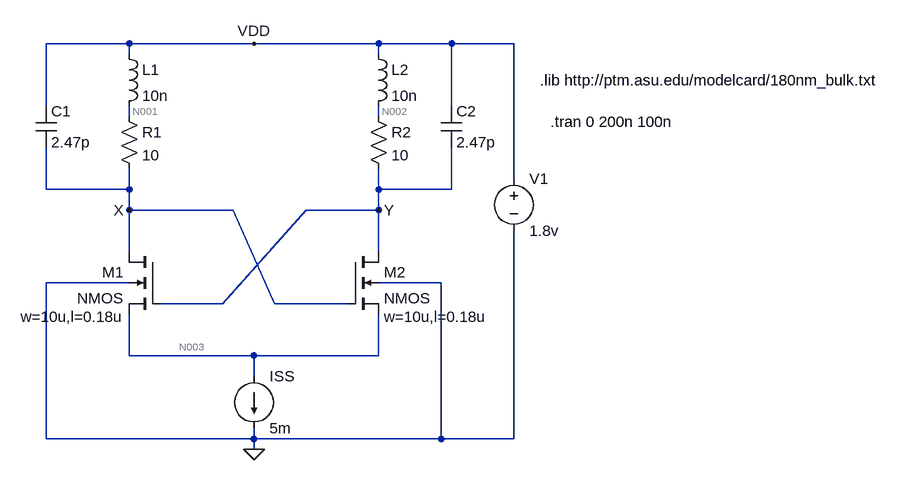
[diagram p0: schematic Draft1.asc]
Draft1.asc, the LTspice schematic file:
Version 4
SHEET 1 1128 740
WIRE -112 -16 -240 -16
WIRE 80 -16 -112 -16
WIRE 272 -16 80 -16
WIRE 384 -16 272 -16
WIRE 480 -16 384 -16
WIRE -112 0 -112 -16
WIRE 272 0 272 -16
WIRE -240 80 -240 -16
WIRE 384 80 384 -16
WIRE -112 96 -112 80
WIRE 272 96 272 80
WIRE 480 192 480 -16
WIRE -240 208 -240 144
WIRE -112 208 -112 176
WIRE -112 208 -240 208
WIRE 272 208 272 176
WIRE 384 208 384 144
WIRE 384 208 272 208
WIRE -112 240 -112 208
WIRE 48 240 -112 240
WIRE 272 240 272 208
WIRE 272 240 160 240
WIRE -112 304 -112 240
WIRE 272 304 272 240
WIRE -112 352 -240 352
WIRE 368 352 272 352
WIRE 32 384 160 240
WIRE 32 384 -64 384
WIRE 112 384 48 240
WIRE 224 384 112 384
WIRE -112 464 -112 400
WIRE 80 464 -112 464
WIRE 272 464 272 400
WIRE 272 464 80 464
WIRE 80 496 80 464
WIRE -240 592 -240 352
WIRE 80 592 80 576
WIRE 80 592 -240 592
WIRE 368 592 368 352
WIRE 368 592 80 592
WIRE 480 592 480 272
WIRE 480 592 368 592
WIRE 80 608 80 592
FLAG 80 608 0
FLAG 272 240 Y
FLAG -112 240 X
FLAG 80 -16 VDD
SYMBOL cap -256 80 R0
SYMATTR InstName C1
SYMATTR Value 2.47p
SYMBOL ind -128 -16 R0
SYMATTR InstName L1
SYMATTR Value 10n
SYMBOL ind 256 -16 R0
SYMATTR InstName L2
SYMATTR Value 10n
SYMBOL cap 368 80 R0
SYMATTR InstName C2
SYMATTR Value 2.47p
SYMBOL nmos4 -64 304 M0
WINDOW 123 56 100 Left 2
SYMATTR InstName M1
SYMATTR Value2 w=10u,l=0.18u
SYMBOL nmos4 224 304 R0
WINDOW 123 56 100 Left 2
SYMATTR InstName M2
SYMATTR Value2 w=10u,l=0.18u
SYMBOL current 80 496 R0
SYMATTR InstName ISS
SYMATTR Value 5m
SYMBOL res -128 80 R0
SYMATTR InstName R1
SYMATTR Value 10
SYMBOL res 256 80 R0
SYMATTR InstName R2
SYMATTR Value 10
SYMBOL voltage 480 176 R0
SYMATTR InstName V1
SYMATTR Value 1.8v
TEXT 520 40 Left 2 !.lib http://ptm.asu.edu/modelcard/180nm_bulk.txt
TEXT 536 104 Left 2 !.tran 0 200n 100n

The netlist it stands for:
* Draft1.asc
C1 VDD X 2.47p
L1 VDD N001 10n
L2 VDD N002 10n
C2 VDD Y 2.47p
M1 X Y N003 0 NMOS w=10u,l=0.18u
M2 Y X N003 0 NMOS w=10u,l=0.18u
ISS N003 0 5m
R1 N001 X 10
R2 N002 Y 10
V1 VDD 0 1.8v
.model NMOS NMOS
.model PMOS PMOS
.lib standard.mos
.lib http://ptm.asu.edu/modelcard/180nm_bulk.txt
.tran 0 200n 100n
.backanno
.end

* Results of the author's LTspice run, read from the files saved beside the schematic
* Operating Point, zero values left out:
*   V(vdd) = 1.8 V
*   V(x) = 1.775 V
*   V(n001) = 1.8 V
*   V(n002) = 1.8 V
*   V(y) = 1.775 V
*   V(n003) = 680.4 mV
*   Id(M2) = 2.5 mA
*   Ib(M2) = -2.475 pA
*   Is(M2) = -2.5 mA
*   Id(M1) = 2.5 mA
*   Ib(M1) = -2.475 pA
*   Is(M1) = -2.5 mA
*   I(L2) = 2.5 mA
*   I(L1) = 2.5 mA
*   I(Iss) = 5 mA
*   I(R2) = 2.5 mA
*   I(R1) = 2.5 mA
*   I(V1) = -5 mA
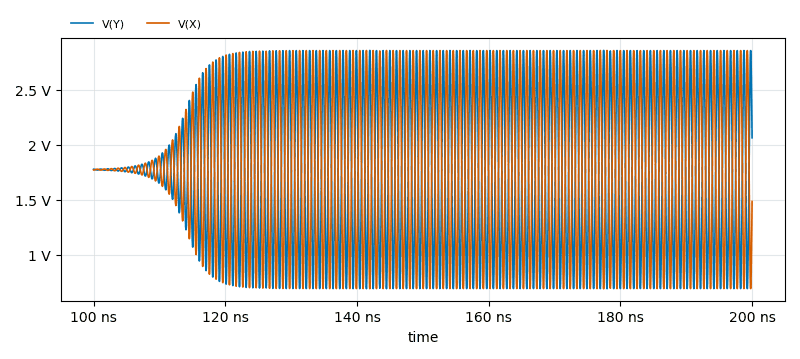
[diagram p1: Transient Analysis of Draft1.asc, plotted from the saved traces]
* Transient Analysis, 1 run:
*   V(Y): min 691.2 mV, max 2.86 V, average 1.777 V, rms 1.911 V, last 2.064 V
*   V(X): min 690.2 mV, max 2.859 V, average 1.773 V, rms 1.907 V, last 1.485 V